# Altium schematic sheet PSFB_bus_sense.SchDoc
size 420 x 297 mm
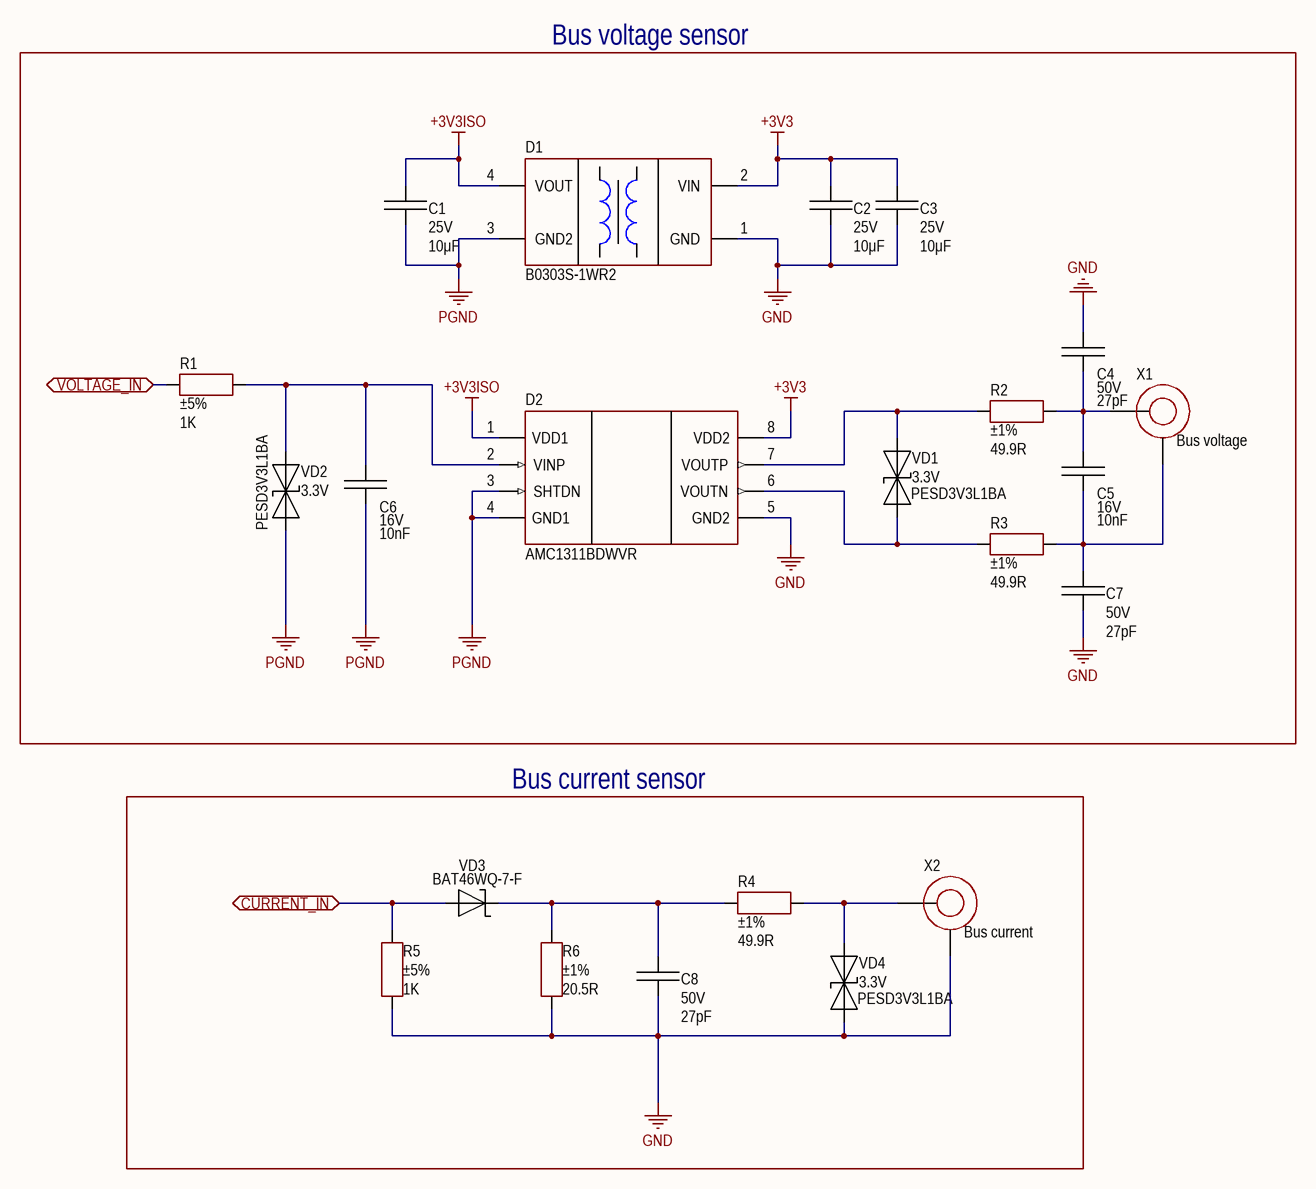
[diagram p0: PSFB_bus_sense.SchDoc]

## Parts
C1  value 10μF  Voltage: 25V  [CAP: 1206]
C2  value 10μF  Voltage: 25V  [CAP: 1206]
C3  value 10μF  Voltage: 25V  [CAP: 1206]
C4  value 27pF  Voltage: 50V  [CAP: 0805]
C5  value 10nF  Voltage: 16V  [CAP: 0805]
C6  value 10nF  Voltage: 16V  [CAP: 0805]
C7  value 27pF  Voltage: 50V  [CAP: 0805]
C8  value 27pF  Voltage: 50V  [CAP: 0805]
D1  PartNumber: B0303S-1WR2  [MOD: SIP-4 (B0505S-1W)]
D2  PartNumber: AMC1311BDWVR  [8-SOIC-W]
R1  value 1K  Tolerance: ±5%  [RES: 0805]
R2  value 49.9R  Tolerance: ±1%  [RES: 0805]
R3  value 49.9R  Tolerance: ±1%  [RES: 0805]
R4  value 49.9R  Tolerance: ±1%  [RES: 0805]
R5  value 1K  Tolerance: ±5%  [RES: 0805]
R6  value 20.5R  Tolerance: ±1%  [RES: 2512]
VD1  Voltage: 3.3V  PartNumber: PESD3V3L1BA  [DIODE: SOD323]
VD2  Voltage: 3.3V  PartNumber: PESD3V3L1BA  [DIODE: SOD323]
VD3  PartNumber: BAT46WQ-7-F  [DIODE: SOD123]
VD4  Voltage: 3.3V  PartNumber: PESD3V3L1BA  [DIODE: SOD323]
X1  CommentText: Bus voltage  [60311002111526]
X2  CommentText: Bus current  [60311002111526]

## Blocks framed on the sheet
Bus voltage sensor: C1-C7 D1 D2 R1-R3 VD1 VD2 X1
Bus current sensor: C8 R4-R6 VD3 VD4 X2

## Ports
CURRENT_IN (bidir), VOLTAGE_IN (bidir)

## Nets
+3V3: C2.2 C3.2 D1.2(VIN) D2.8(VDD2)
+3V3ISO: C1.2 D1.4(VOUT) D2.1(VDD1)
GND: C2.1 C3.1 C4.2 C7.2 C8.2 D1.1(GND) D2.5(GND2) R5.1 R6.1 VD4.1(A) X2.2
PGND: C1.1 C6.1 D1.3(GND2) D2.3(SHTDN) D2.4(GND1) VD2.1(A)
CURRENT_IN: R5.2 VD3.1 ; port CURRENT_IN
VOLTAGE_IN: R1.2 ; port VOLTAGE_IN
NetC4_1: C4.1 C5.2 R2.1 X1.1
NetC5_1: C5.1 C7.1 R3.1 X1.2
NetC6_2: C6.2 D2.2(VINP) R1.1 VD2.2(C)
NetC8_1: C8.1 R4.2 R6.2 VD3.2
NetD2_6: D2.6(VOUTN) R3.2 VD1.1(A)
NetD2_7: D2.7(VOUTP) R2.2 VD1.2(C)
NetR4_1: R4.1 VD4.2(C) X2.1

## Notes on the sheet
- Author
- Manufacturer
- Date
- Page
- Total pages
- Size page
- A3
- Materials

## Library data of the parts
C1-C3 = Ceramic_1206: 10µF ±10% 25V Ceramic Capacitor X7R 1206 (3216 Metric); Manufacturer: Yageo; PartNumber: CC1206KKX7R8BB106; ValueManufacturerPartNumber: Ceramic capacitor, 10μF, X7R, ±10%, 25V, 1206, -55...+125°C; Package: 1206; HelpURL: https://www.digikey.com/en/products/detail/yageo/CC1206KKX7R8BB106/5195365; Temperature: -55...+125°C; TypeCapacitor: Ceramic capacitor; Tolerance: ±10%; TypeDielectric: X7R
C4 C7 C8 = Ceramic_0805: 27pF ±5% 50V Ceramic Capacitor C0G, NP0 0805 (2012 Metric); Manufacturer: Yageo; PartNumber: CC0805JRNPO9BN270; ValueManufacturerPartNumber: Ceramic capacitor, 27pF, NP0, ±10%, 50V, 0805, -55...+125°C; Tolerance: ±10%; Package: 0805; HelpURL: https://www.digikey.com/en/products/detail/yageo/CC0805JRNPO9BN270/302838; Temperature: -55...+125°C; TypeCapacitor: Ceramic capacitor; TypeDielectric: NP0
C5 C6 = Ceramic_0805: 27pF ±5% 50V Ceramic Capacitor C0G, NP0 0805 (2012 Metric); Manufacturer: Yageo; PartNumber: CC0805JKNPO7BN103; ValueManufacturerPartNumber: Ceramic capacitor, 10nF, NP0, ±10%, 16V, 0805, -55...+125°C; Tolerance: ±10%; Package: 0805; HelpURL: https://www.digikey.com/en/products/detail/yageo/CC0805JKNPO7BN103/5884010; Temperature: -55...+125°C; TypeCapacitor: Ceramic capacitor; TypeDielectric: NP0
D1 = B0505S-1WR2: Isolated Module DC DC Converter 1 Output 3.3V 303mA 2.97V - 3.63V Input; Manufacturer: Mornsun; ValueManufacturerPartNumber: DC/DC converter, isolator, 5V 200mA, -40...+105°C, SIP-4; OutputType: isolator; OutputVoltage: 5V 200mA; HelpURL: https://lcsc.com/product-detail/Power-Modules_MORNSUN-Guangzhou-S-T-B0303S-1WR2_C70480.html; Package: SIP-4; ComponentType: DC/DC converter; Temperature: -40...+105°C
D2 = AMC1200BDWVR: Isolator amplifier; Manufacturer: Texas Instruments; ValueManufacturerPartNumber: IC isolator amplifier, Differential, 220 kHz, 2.7...5.5V, -40...+105°C, 8-SOIC; Supply: 2.7...5.5V; OutputType: Differential; GainBandwidth: 220 kHz; HelpURL: https://www.digikey.com/en/products/detail/texas-instruments/AMC1311BDWVR/8020495; Package: 8-SOIC; ComponentType: IC isolator amplifier; Temperature: -40...+105°C
R1 R5 = Resistor_0805: 1 kOhms ±5% 0.125W, 1/8W Chip Resistor 0805 (2012 Metric) Moisture Resistant Thick Film; Manufacturer: Yageo; PartNumber: RC0805JR-071KL; ValueManufacturerPartNumber: Resistor film, 1K, ±5%, 0805, 0.125W, -55...+125°C; TypeResistor: Resistor film; Package: 0805; HelpURL: https://www.digikey.com/en/products/detail/yageo/RC0805JR-071KL/728218; Temperature: -55...+125°C; Power: 0.125W
R2-R4 = Resistor_0805: 49.9 Ohms ±1% 0.125W, 1/8W Chip Resistor 0805 (2012 Metric) Moisture Resistant Thick Film; Manufacturer: Yageo; PartNumber: RC0805FR-0749R9L; ValueManufacturerPartNumber: Resistor film, 49.9R, ±1%, 0805, 0.125W, -55...+125°C; TypeResistor: Resistor film; Package: 0805; HelpURL: https://www.digikey.com/en/products/detail/yageo/RC0805FR-0749R9L/727984; Temperature: -55...+125°C; Power: 0.125W
R6 = Resistor_2512: 20.5 Ohms ±1% 1W Chip Resistor 2512 (6432 Metric) Moisture Resistant Thick Film; Manufacturer: Yageo; PartNumber: RC2512FK-0720R5L; ValueManufacturerPartNumber: Resistor film, 20.5R, ±1%, 2512, 1W, -55...+125°C; TypeResistor: Resistor film; Package: 2512; HelpURL: https://www.digikey.com/en/products/detail/yageo/RC2512FK-0720R5L/5921990; Temperature: -55...+125°C; Power: 1W
VD1 VD2 VD4 = TVS_single: 3.3V Reverse Standoff 26V Clamp 18A (8/20µs) Ipp Tvs Diode Surface Mount SOD-323; Manufacturer: Diodes Incorporated; Current: 500W; Package: SOD-323; HelpURL: https://www.digikey.com/en/products/detail/nexperia-usa-inc/PESD3V3L1BA-115/1157438; ValueManufacturerPartNumber: =TypeDiode+', '+Voltage+', '+Current+', '+VoltageDrop+', '+RecoveryTime+', '+Package+', '+Temperature; Temperature: -55...+150°C; TypeDiode: TVS diode
VD3 = Schottky_single: Diode Schottky 100V 150mA Surface Mount SOD-123; Manufacturer: Diodes Incorporated; ValueManufacturerPartNumber: Schottky diode, 100V, 1A, 0.45V, 15pF, SOD-123, -55...+150°C; TypeDiode: Schottky diode; Current: 1A; VoltageDrop: 0.45V; RecoveryTime: 15pF; Package: SOD-123; HelpURL: https://www.digikey.com/en/products/detail/diodes-incorporated/BAT46WQ-7-F/6003945; Temperature: -55...+150°C; Voltage: 100V
X1 X2 = Connector_SMA: SMA Connector Jack, Female Socket 50Ohm Through Hole Solder; Manufacturer: Würth Elektronik; ValueManufacturerPartNumber: Connector SMA, 50 Ohm, 6Hz; TypeConnector: Connector SMA; Frequency: 6Hz; HelpURL: https://www.we-online.com/catalog/en/WR-SMA_60311002111526; PartNumber: 60311002111526; Impedance: 50 Ohm